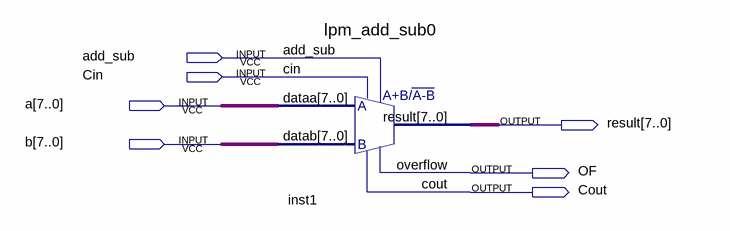
[diagram p0: schematic sheet]
// Quartus schematic add_sub.bdf as structural Verilog: 1 symbols, 7 pins
module add_sub (
  input  add_sub,
  input  Cin,
  input  [7:0] a,
  input  [7:0] b,
  output [7:0] result,
  output OF,
  output Cout
);

  lpm_add_sub0 inst1 (.dataa(a), .datab(b), .add_sub(add_sub), .cin(Cin), .result(result), .overflow(OF), .cout(Cout));
endmodule
